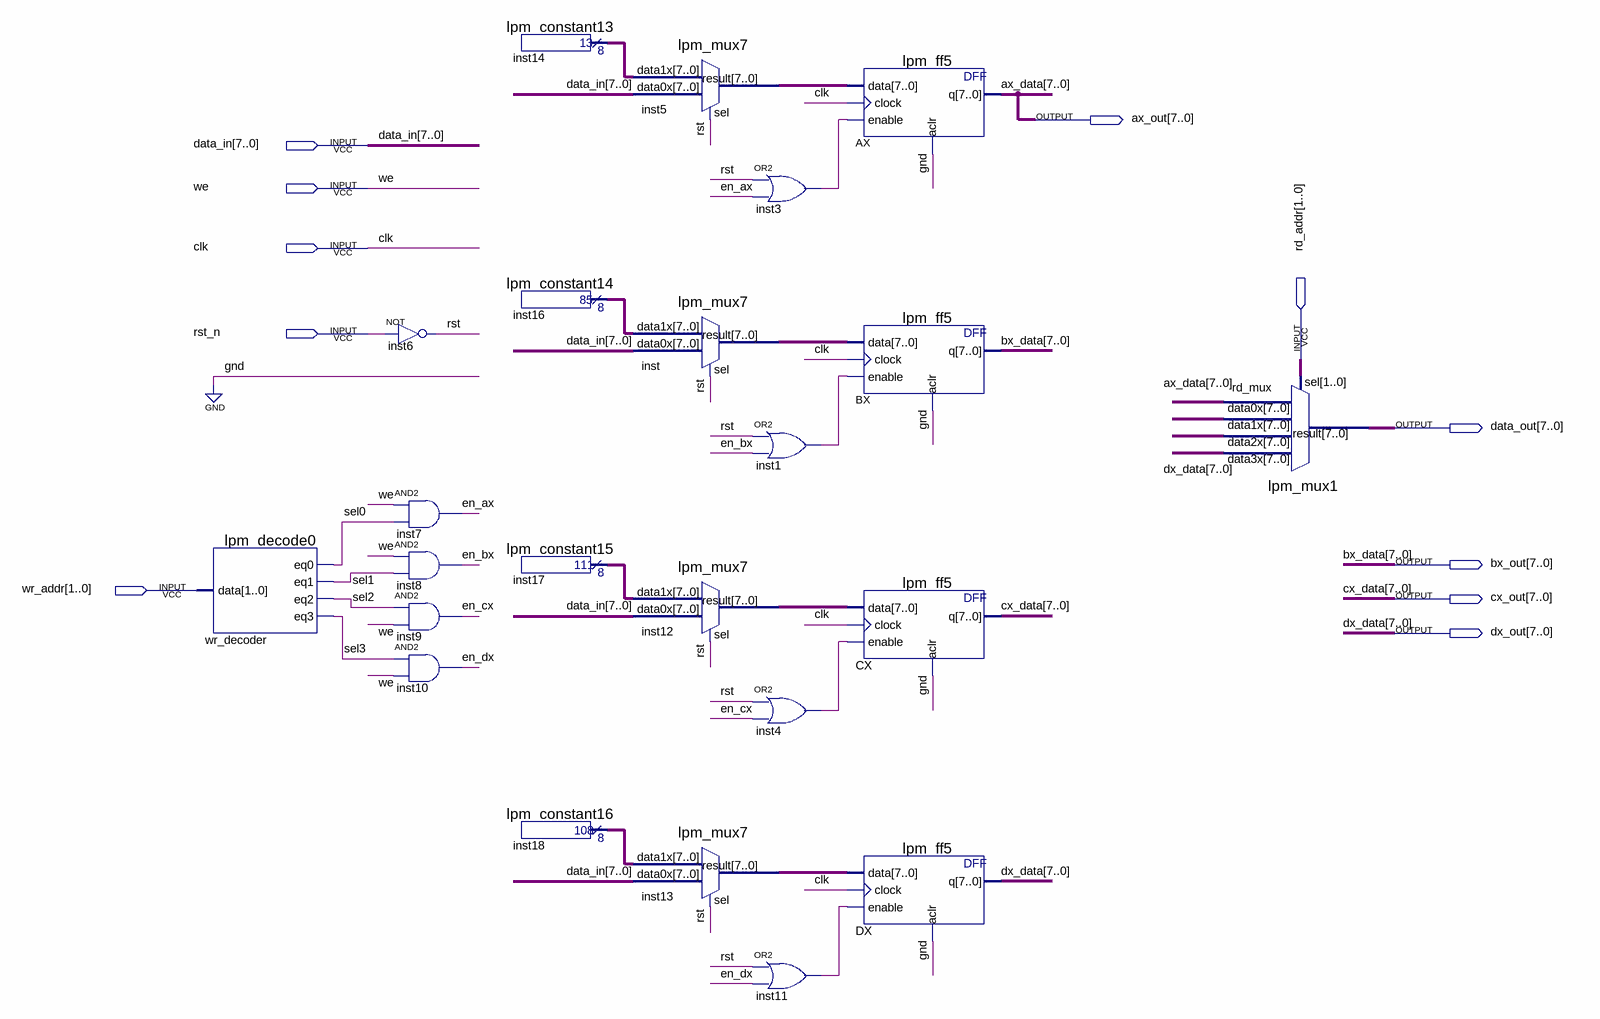
[diagram p0: schematic sheet]
// Quartus schematic ron_unit.bdf as structural Verilog: 23 symbols, 11 pins
module ron_unit (
  input  [7:0] data_in,
  input  we,
  input  clk,
  input  rst_n,
  input  [1:0] rd_addr,
  input  [1:0] wr_addr,
  output [7:0] ax_out,
  output [7:0] data_out,
  output [7:0] bx_out,
  output [7:0] cx_out,
  output [7:0] dx_out
);

  wire en_ax, en_bx, en_cx, en_dx, inst1_out, inst3_out, inst4_out, inst11_out, rst, sel0, sel1, sel2, sel3;
  wire [7:0] inst5_result, inst12_result, inst13_result, inst14_result, inst16_result, inst17_result,
       inst18_result, inst_result;

  lpm_decode0 wr_decoder (.data(wr_addr), .eq0(sel0), .eq1(sel1), .eq2(sel2), .eq3(sel3));
  not inst6 (rst, rst_n);
  and inst7 (en_ax, we, sel0);
  and inst8 (en_bx, we, sel1);
  and inst9 (en_cx, sel2, we);
  and inst10 (en_dx, sel3, we);
  lpm_constant13 inst14 (.result(inst14_result));
  lpm_constant14 inst16 (.result(inst16_result));
  lpm_constant15 inst17 (.result(inst17_result));
  lpm_constant16 inst18 (.result(inst18_result));
  lpm_mux7 inst5 (.data1x(inst14_result), .data0x(data_in), .sel(rst), .result(inst5_result));
  lpm_mux7 inst (.data1x(inst16_result), .data0x(data_in), .sel(rst), .result(inst_result));
  lpm_mux7 inst12 (.data1x(inst17_result), .data0x(data_in), .sel(rst), .result(inst12_result));
  lpm_mux7 inst13 (.data1x(inst18_result), .data0x(data_in), .sel(rst), .result(inst13_result));
  or inst3 (inst3_out, rst, en_ax);
  or inst1 (inst1_out, rst, en_bx);
  or inst4 (inst4_out, rst, en_cx);
  or inst11 (inst11_out, rst, en_dx);
  lpm_ff5 AX (.data(inst5_result), .clock(clk), .enable(inst3_out), .aclr(1'b0), .q(ax_out));
  lpm_ff5 BX (.data(inst_result), .clock(clk), .enable(inst1_out), .aclr(1'b0), .q(bx_out));
  lpm_ff5 CX (.data(inst12_result), .clock(clk), .enable(inst4_out), .aclr(1'b0), .q(cx_out));
  lpm_ff5 DX (.data(inst13_result), .clock(clk), .enable(inst11_out), .aclr(1'b0), .q(dx_out));
  lpm_mux1 rd_mux (
    .data3x(dx_out), .data2x(cx_out), .data1x(bx_out), .data0x(ax_out), .sel(rd_addr), .result(data_out));

  // Other names for the same wires on the sheet: ax_data[7:0] = ax_out; bx_data[7:0] = bx_out; cx_data[7:0] = cx_out;
  //   dx_data[7:0] = dx_out
endmodule
